# Altium project H2H Main Board v1.0.PrjPCB
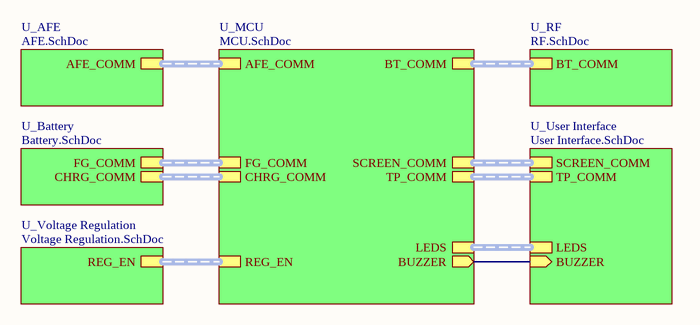
[diagram p0: Main Board.SchDoc]
7 sheets, 166 parts. Net scope: hierarchical (ports join the sheet entries above them; power ports are global).
Board file: Main Board.PcbDoc
Sheets:
  Main Board.SchDoc
    U_AFE = AFE.SchDoc
    U_Battery = Battery.SchDoc
    U_Voltage Regulation = Voltage Regulation.SchDoc
    U_RF = RF.SchDoc
    U_User Interface = User Interface.SchDoc
    U_MCU = MCU.SchDoc

## Sheet Main Board.SchDoc: Main Board
size A4; Date: 2016/01/06; Author: Samuel López; DocumentNumber: 1; SheetNumber: 1; SheetTotal: 7; Project: H2H Main Board

### Sub-sheets
U_AFE = AFE.SchDoc: AFE_COMM (harness AFE_COMM)
U_Battery = Battery.SchDoc: FG_COMM (harness FG_COMM), CHRG_COMM (harness CHRG_COMM)
U_MCU = MCU.SchDoc: SCREEN_COMM (harness SCREEN_COMM), AFE_COMM (harness AFE_COMM), FG_COMM (harness FG_COMM), CHRG_COMM (harness CHRG_COMM), REG_EN (harness REG_EN), BT_COMM (harness BT_COMM), TP_COMM (harness TP_COMM), LEDS (harness LEDS), BUZZER (out)
U_RF = RF.SchDoc: BT_COMM (harness BT_COMM)
U_User Interface = User Interface.SchDoc: SCREEN_COMM (harness SCREEN_COMM), TP_COMM (harness TP_COMM), LEDS (harness LEDS), BUZZER (in)
U_Voltage Regulation = Voltage Regulation.SchDoc: REG_EN (harness REG_EN)

### Nets
UI_BUZZER: sheet U_User Interface/BUZZER, sheet U_MCU/BUZZER

### Buses and harness runs
harness sheet U_AFE/AFE_COMM = sheet U_MCU/AFE_COMM
harness sheet U_Battery/CHRG_COMM = sheet U_MCU/CHRG_COMM
harness sheet U_Battery/FG_COMM = sheet U_MCU/FG_COMM
harness sheet U_MCU/BT_COMM = sheet U_RF/BT_COMM
harness sheet U_MCU/LEDS = sheet U_User Interface/LEDS
harness sheet U_MCU/REG_EN = sheet U_Voltage Regulation/REG_EN
harness sheet U_MCU/SCREEN_COMM = sheet U_User Interface/SCREEN_COMM
harness sheet U_MCU/TP_COMM = sheet U_User Interface/TP_COMM

### Notes on the sheet
- Project:
- Title:
- Sheet
- Author:
- of
- Date:

## Sheet AFE.SchDoc: Analog Front End
size A4; Date: 2016/01/04; Author: Samuel López; DocumentNumber: 2; SheetNumber: 2; SheetTotal: 7; Project: H2H Main Board
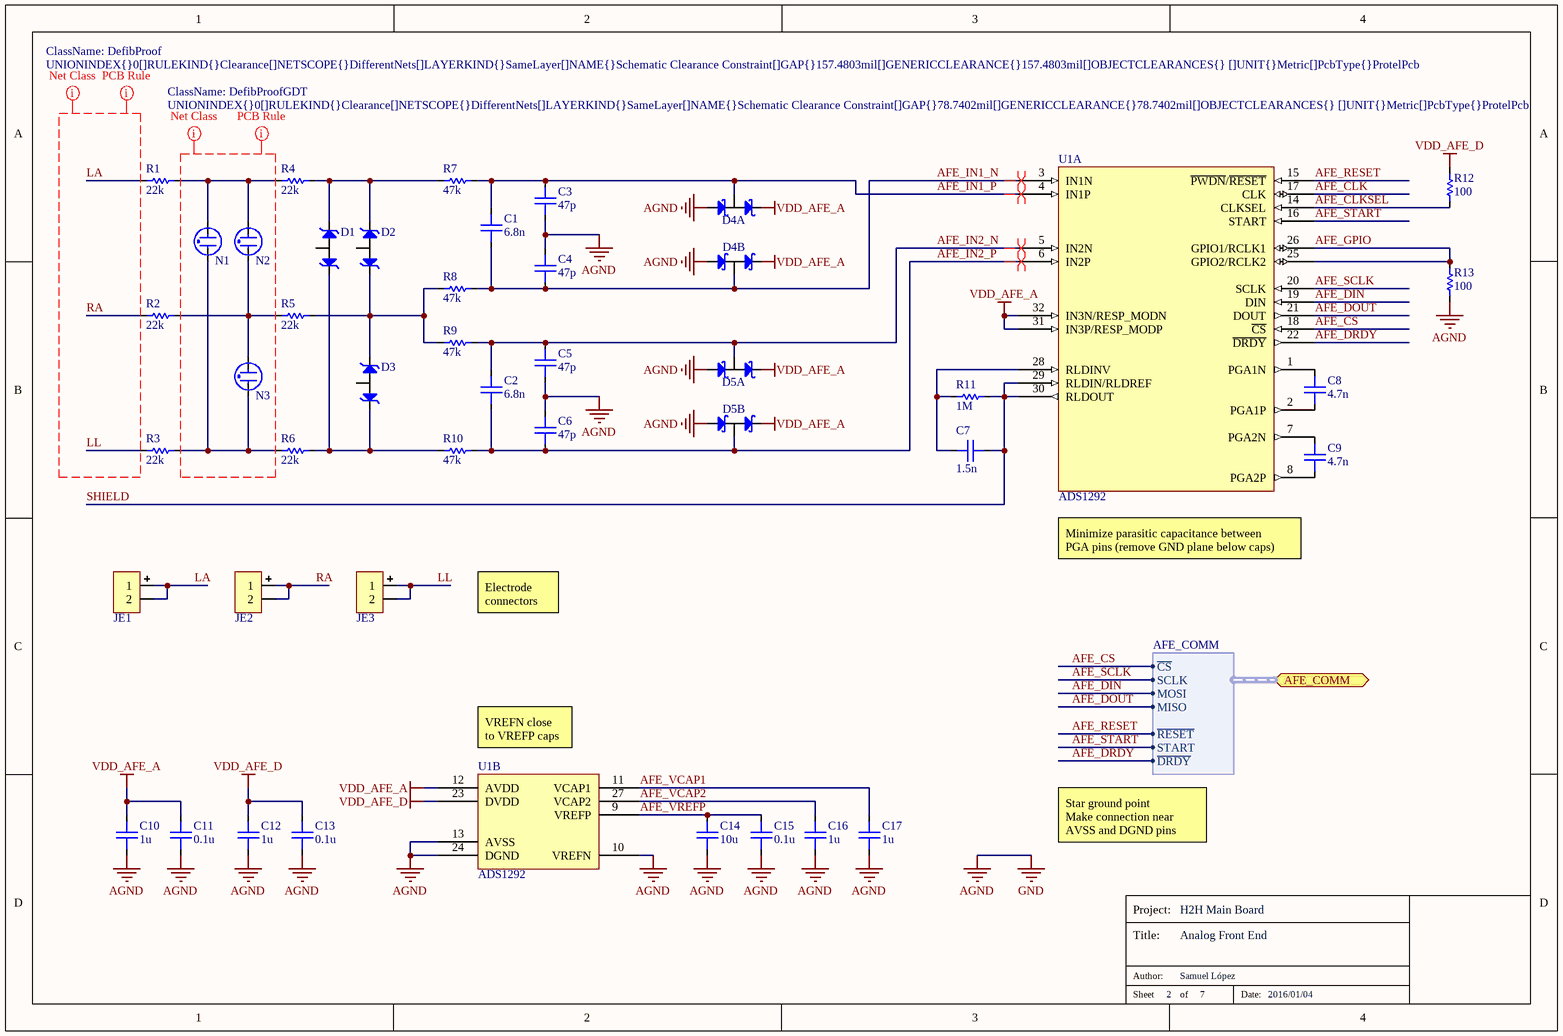
[diagram p1: AFE.SchDoc]

### Parts
C1  6.8n  [C0603]
C2  6.8n  [C0603]
C3  47p  [C0603]
C4  47p  [C0603]
C5  47p  [C0603]
C6  47p  [C0603]
C7  1.5n  [C0603]
C8  4.7n  [C0603]
C9  4.7n  [C0603]
C10  1u  [C0603]
C11  0.1u  [C0603]
C12  1u  [C0603]
C13  0.1u  [C0603]
C14  10u  [C0603]
C15  0.1u  [C0603]
C16  1u  [C0603]
C17  1u  [C0603]
D1  PESD5V0X1  [PESD5V0X1BT]  (value not drawn)
D2  PESD5V0X1  [PESD5V0X1BT]  (value not drawn)
D3  PESD5V0X1  [PESD5V0X1BT]  (value not drawn)
D4  BAS70DW-04  [BAS70DW-04]  (value not drawn)  (parts A,B of 2)
D5  BAS70DW-04  [BAS70DW-04]  (value not drawn)  (parts A,B of 2)
JE1  JST PH 2 Pin  [S2B-PH-K-S]  (value not drawn)
JE2  JST PH 2 Pin  [S2B-PH-K-S]  (value not drawn)
JE3  JST PH 2 Pin  [S2B-PH-K-S]  (value not drawn)
N1  GDT  [2051-09-SM]  (value not drawn)
N2  GDT  [2051-09-SM]  (value not drawn)
N3  GDT  [2051-09-SM]  (value not drawn)
R1  22k  [R2512]
R2  22k  [R2512]
R3  22k  [R2512]
R4  22k  [R2512]
R5  22k  [R2512]
R6  22k  [R2512]
R7  47k  [R0603]
R8  47k  [R0603]
R9  47k  [R0603]
R10  47k  [R0603]
R11  1M  [R0603]
R12  100  [R0603]
R13  100  [R0603]
U1  ADS1292  [ADS129x]  (parts A,B of 2)

### Ports
AFE_COMM (harness AFE_COMM)

### Harnesses
AFE_COMM: SCLK, MOSI, MISO, ~{CS}, ~{RESET}, START, ~{DRDY}

### Nets
AGND: C3.1 C4.2 C5.1 C6.2 C10.1 C11.1 C12.1 C13.1 C14.1 C15.1 C16.1 C17.1 D4.1(A1) D4.4(A2) D5.1(A1) D5.4(A2) R13.2 U1.10(VREFN) U1.13(AVSS) U1.24(DGND)  [also labelled GND]
VDD_AFE_A: C10.2 C11.2 D4.2(K1) D4.5(K2) D5.2(K1) D5.5(K2) U1.12(AVDD) U1.31(IN3P/RESP_MODP) U1.32(IN3N/RESP_MODN)
VDD_AFE_D: C12.2 C13.2 R12.1 U1.23(DVDD)
AFE_CLK: U1.17(CLK)
AFE_CLKSEL: R12.2 U1.14(CLKSEL)
AFE_CS: U1.18(~{CS}) ; port AFE_COMM.~{CS}
AFE_DIN: U1.19(DIN) ; port AFE_COMM.MOSI
AFE_DOUT: U1.21(DOUT) ; port AFE_COMM.MISO
AFE_DRDY: U1.22(~{DRDY}) ; port AFE_COMM.~{DRDY}
AFE_GPIO: R13.1 U1.25(GPIO2/RCLK2) U1.26(GPIO1/RCLK1)
AFE_IN1_N: C1.1 C4.1 D4.3(AK2) R8.2 U1.3(IN1N)
AFE_IN1_P: C1.2 C3.2 D4.6(AK1) R7.2 U1.4(IN1P)
AFE_IN2_N: C2.2 C5.2 D5.6(AK1) R9.2 U1.5(IN2N)
AFE_IN2_P: C2.1 C6.1 D5.3(AK2) R10.2 U1.6(IN2P)
AFE_RESET: U1.15(~{PWDN}/~{RESET}) ; port AFE_COMM.~{RESET}
AFE_SCLK: U1.20(SCLK) ; port AFE_COMM.SCLK
AFE_START: U1.16(START) ; port AFE_COMM.START
AFE_VCAP1: C17.2 U1.11(VCAP1)
AFE_VCAP2: C16.2 U1.27(VCAP2)
AFE_VREFP: C14.2 C15.2 U1.9(VREFP)
LA: JE1.1 JE1.2 R1.1
LL: JE3.1 JE3.2 R3.1
RA: JE2.1 JE2.2 R2.1
SHIELD: C7.1 R11.2 U1.29(RLDIN/RLDREF) U1.30(RLDOUT)
NetC7_2: C7.2 R11.1 U1.28(RLDINV)
NetC8_1: C8.1 U1.2(PGA1P)
NetC8_2: C8.2 U1.1(PGA1N)
NetC9_1: C9.1 U1.8(PGA2P)
NetC9_2: C9.2 U1.7(PGA2N)
NetD1_1: D1.1(K1) D3.1(K1) R6.2 R10.1
NetD1_2: D1.2(K2) D2.2(K2) R4.2 R7.1
NetD2_1: D2.1(K1) D3.2(K2) R5.2 R8.1 R9.1
NetN1_1: N1.1 N3.1 R3.2 R6.1
NetN1_2: N1.2 N2.2 R1.2 R4.1
NetN2_1: N2.1 N3.2 R2.2 R5.1

Not connected (* = marked no-connect by the designer): D1 3(A); D2 3(A); D3 3(A)

### Layout directives
differential pair: AFE_IN1_N, AFE_IN1_P, AFE_IN2_N, AFE_IN2_P
net class DefibProof: LA, LL, RA
rule Clearance Constraint [Clearance = 4mm]: LA, LL, RA
net class DefibProofGDT: (no net found under the mark)
rule Clearance Constraint [Clearance = 2mm]: (no net found under the mark)

### Notes on the sheet
- Minimize parasitic capacitance between
  PGA pins (remove GND plane below caps)
- Electrode
  connectors
- (near U1) VREFN close
  to VREFP caps
- Star ground point
  Make connection near AVSS and DGND pins
- Project:
- Title:
- Sheet
- Author:
- of
- Date:

### Library data of the parts
C1-C17 = Capacitor: Rated Voltage: *
  C1 C2: Value: 6.8n
  C3-C6: Value: 47p
  C7: Value: 1.5n
  C8 C9: Value: 4.7n
  C10 C12 C16 C17: Value: 1u
  C11 C13 C15: Value: 0.1u
  C14: Value: 10u
D1-D3 = PESD5V0X1: TVS - Bidirectional Zener Diode; Capacitance: 1 pF; Supplier 1: Digi-Key; Supplier Part Number 1: 568-4676-1-ND
D4 D5 = BAS70DW-04: TVS - Dual Schottky Rail-to-rail Protection; Supplier 1: Digi-Key; Supplier Part Number 1: BAS70DW-04FDICT-ND
JE1-JE3 = S2B-PH-K-S: Conn - Battery, Male, 2 Pin, PCB, Right Angle; Supplier 1: Digi-Key; Supplier Part Number 1: 455-1719-ND
N1-N3 = 2051-09-SM: TVS - Gas Discharge Tube; DC Sparkover: 90 V; Impulse Sparkover (1000V/us): <600 V; Glow Voltage: 70 V; Arc Voltage: 10 V; Glow-Arc Transition Current: <1 A; Impulse Sparkover (100V/us): <500 V; Supplier 1: Digi-Key; Supplier Part Number 1: 2051-09-SM-RPLFCT-ND
R1-R13 = Resistor: Power: *
  R1-R6: Value: 22k
  R7-R10: Value: 47k
  R11: Value: 1M
  R12 R13: Value: 100
U1 = ADS1292: IC - Analog Front End - Medical; Supplier 1: Digi-Key; Supplier Part Number 1: 296-30137-5-ND

## Sheet Battery.SchDoc: Battery
size A4; Date: 2016/01/04; Author: Samuel López; DocumentNumber: 3; SheetNumber: 3; SheetTotal: 7; Project: H2H Main Board
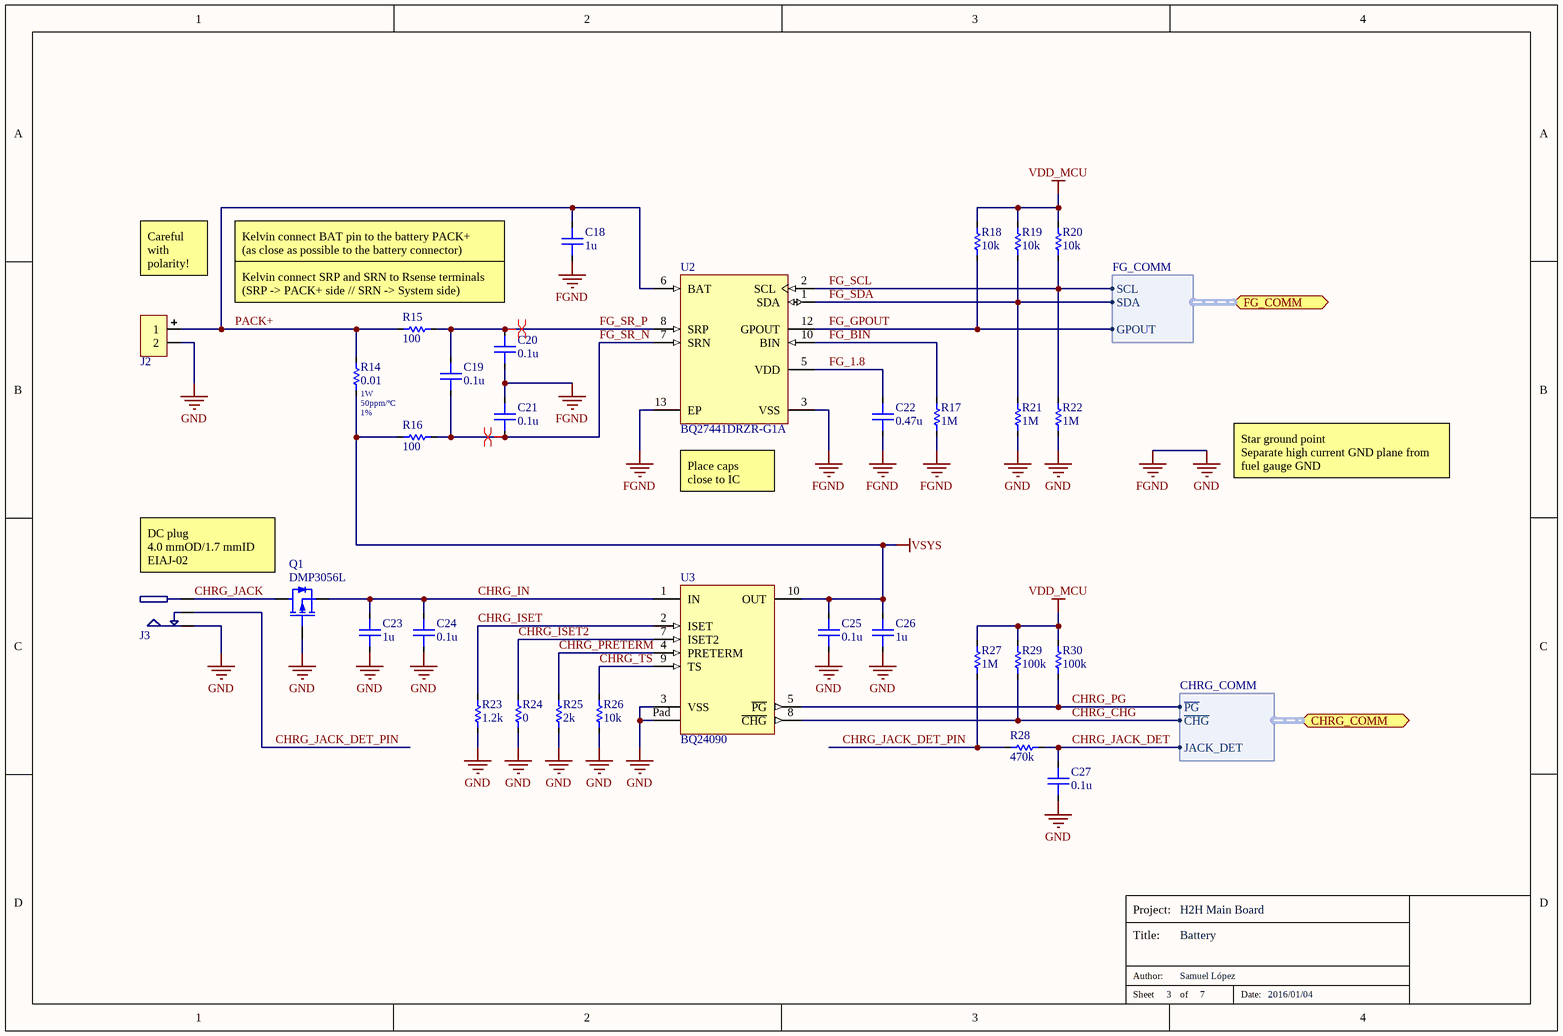
[diagram p2: Battery.SchDoc]

### Parts
C18  1u  [C0603]
C19  0.1u  [C0603]
C20  0.1u  [C0603]
C21  0.1u  [C0603]
C22  0.47u  [C0603]
C23  1u  [C0603]
C24  0.1u  [C0603]
C25  0.1u  [C0603]
C26  1u  [C0603]
C27  0.1u  [C0603]
J2  JST PH 2 Pin  [S2B-PH-K-S]  (value not drawn)
J3  PJ-018H-SMT  [PJ-018H-SMT]  (value not drawn)
Q1  DMP3056L  [DMP3056L]
R14  0.01  Power: 1W  Tolerance: 1%  Temp. coef.: 50ppm/ºC  [R1206]
R15  100  [R0603]
R16  100  [R0603]
R17  1M  [R0603]
R18  10k  [R0603]
R19  10k  [R0603]
R20  10k  [R0603]
R21  1M  [R0603]
R22  1M  [R0603]
R23  1.2k  [R0603]
R24  0  [R0603]
R25  2k  [R0603]
R26  10k  [R0603]
R27  1M  [R0603]
R28  470k  [R0603]
R29  100k  [R0603]
R30  100k  [R0603]
U2  BQ27441DRZR-G1A  [BQ27441DRZx-G1A]
U3  BQ24090  [BQ24090]

### Ports
CHRG_COMM (harness CHRG_COMM), FG_COMM (harness FG_COMM)

### Harnesses
FG_COMM: SCL, SDA, GPOUT
CHRG_COMM: ~{PG}, ~{CHG}, JACK_DET

### Nets
FGND: C18.1 C20.1 C21.2 C22.1 C23.1 C24.1 C25.1 C26.1 C27.1 J2.2 J3.2 Q1.1(G) R17.2 R21.2 R22.2 R23.2 R24.2 R25.2 R26.2 U2.3(VSS) U2.13(EP) U3.3(VSS) U3.Pad(Thermal)  [also labelled GND]  [project net AGND]
VDD_MCU: R18.1 R19.1 R20.1 R27.1 R29.1 R30.1
VSYS: C25.2 C26.2 R14.2 R16.1 U3.10(OUT)
CHRG_CHG: R29.2 U3.8(~{CHG}) ; port CHRG_COMM.~{CHG}
CHRG_IN: C23.2 C24.2 Q1.2(S) U3.1(IN)
CHRG_ISET: R23.1 U3.2(ISET)
CHRG_ISET2: R24.1 U3.7(ISET2)
CHRG_JACK: J3.1 Q1.3(D)
CHRG_JACK_DET: C27.2 R28.1 ; port CHRG_COMM.JACK_DET
CHRG_JACK_DET_PIN: J3.3 R27.2 R28.2
CHRG_PG: R30.2 U3.5(~{PG}) ; port CHRG_COMM.~{PG}
CHRG_PRETERM: R25.1 U3.4(PRETERM)
CHRG_TS: R26.1 U3.9(TS)
FG_1.8: C22.2 U2.5(VDD)
FG_BIN: R17.1 U2.10(BIN)
FG_GPOUT: R18.2 U2.12(GPOUT) ; port FG_COMM.GPOUT
FG_SCL: R20.2 R22.1 U2.2(SCL) ; port FG_COMM.SCL
FG_SDA: R19.2 R21.1 U2.1(SDA) ; port FG_COMM.SDA
FG_SR_N: C19.1 C21.1 R16.2 U2.7(SRN)
FG_SR_P: C19.2 C20.2 R15.2 U2.8(SRP)
PACK+: C18.2 J2.1 R14.1 R15.1 U2.6(BAT)

### Layout directives
differential pair: FG_SR_N, FG_SR_P

### Notes on the sheet
- Careful with
  polarity!
- Kelvin connect BAT pin to the battery PACK+
  (as close as possible to the battery connector)
- Kelvin connect SRP and SRN to Rsense terminals
  (SRP -> PACK+ side // SRN -> System side)
- (near U2) Place caps
  close to IC
- Star ground point
  Separate high current GND plane from
  fuel gauge GND
- DC plug
  4.0 mmOD/1.7 mmID
  EIAJ-02
- Project:
- Title:
- Sheet
- Author:
- of
- Date:

### Library data of the parts
C18-C27 = Capacitor: Rated Voltage: *
  C18 C23 C26: Value: 1u
  C19-C21 C24 C25 C27: Value: 0.1u
  C22: Value: 0.47u
J2 = S2B-PH-K-S: as JE1 on sheet AFE; Supplier 1: Digi-Key; Supplier Part Number 1: 455-1719-ND
J3 = PJ-018H-SMT: Conn - DC Power Plug - 4.0 mmOD / 1.7 mmID; Inner Diameter: 1.7 mm; Outer Diameter: 4.0 mm; DC Conn Standard: EIAJ-02; Supplier 1: Digi-Key; Supplier Part Number 1: CP-018HPJCT-ND
Q1 = DMP3056L: Transistor - MOSFET, P-Channel, 30V, 4.3A; RDSon @ VGS =-4.5V: 50 m; Supplier 1: Digi-Key; Supplier Part Number 1: DMP3056L-7DICT-ND
R14-R30 = Resistor
  R14: Value: 0.01; Supplier 1: Digi-Key; Supplier Part Number 1: MCS1632R010FERCT-ND
  R15 R16: Value: 100; Power: *
  R17 R21 R22 R27: Value: 1M; Power: *
  R18-R20 R26: Value: 10k; Power: *
  R23: Value: 1.2k; Power: *
  R24: Value: 0; Power: *
  R25: Value: 2k; Power: *
  R28: Value: 470k; Power: *
  R29 R30: Value: 100k; Power: *
U2 = BQ27441DRZR-G1A: IC - Fuel Gauge, System-Side Impedance Track; PartNumber: BQ27410DRZR-G1A; Manufacturer: Texas Instruments; Eco-Plan: Green (RoHS & no Sb/Br); Lead Acid: N; Li-Ion: Y; SubFamily: Battery Fuel Gauge; DatasheetVersion: SLUSAF4; PackageVersion: revB, Apr-2006; PackageReference: DRZ12-1950X2450TP; PackageDescription: 12-Pin Plastic Small Outline No-Lead, 4 x 2.5 x 1 mm Body, 0.4 mm Pitch, Exposed Pad, Pb-Free; Li-Polymer: Y; NiCd: N; NiMH: N; Over Voltage Protection: N; Mounting Technology: Surface Mount; ComponentLink1Description: Datasheet; ComponentLink1URL: http://www.ti.com/general/docs/lit/getliterature.tsp?genericPartNumber=BQ27410-G1&fileType=pdf; Supplier 1: Digi-Key; Supplier Part Number 1: 296-39941-1-ND
U3 = BQ24090: IC - Battery Charger, Single Cell Li-Ion/LiPo, 1A; Supplier 1: Digi-Key; Supplier Part Number 1: 296-38875-1-ND

## Sheet Voltage Regulation.SchDoc: Voltage Regulation
size A4; Date: 2016/01/05; Author: Samuel López; DocumentNumber: 4; SheetNumber: 4; SheetTotal: 7; Project: H2H Main Board
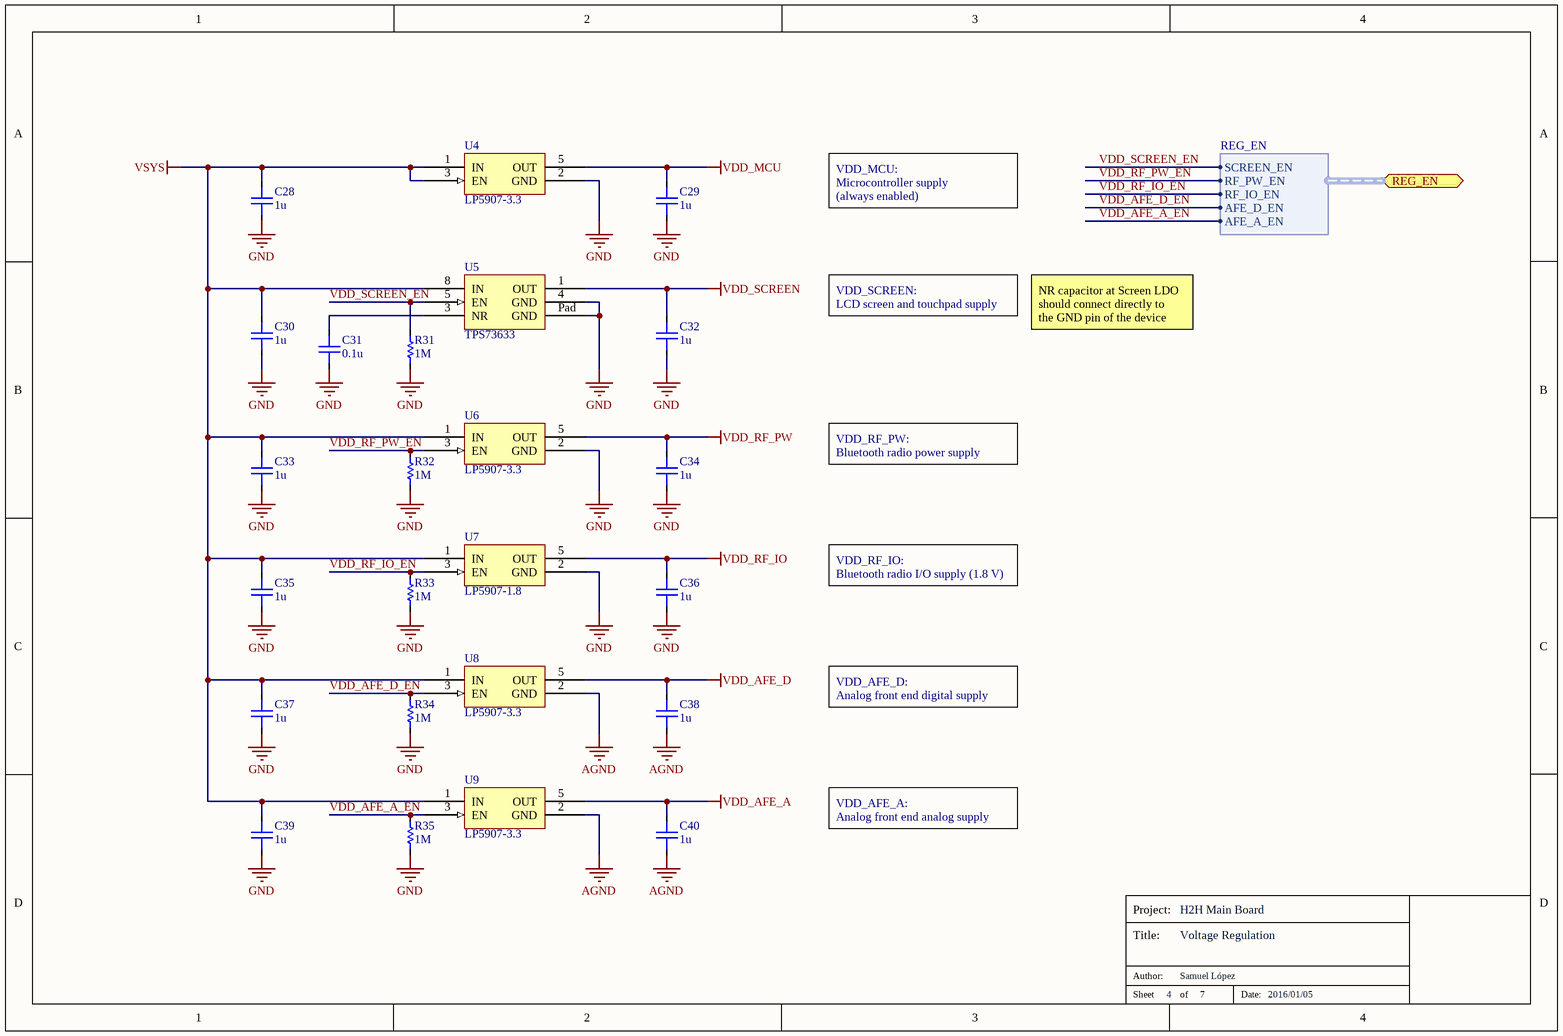
[diagram p3: Voltage Regulation.SchDoc]

### Parts
C28  1u  [C0603]
C29  1u  [C0603]
C30  1u  [C0603]
C31  0.1u  [C0603]
C32  1u  [C0603]
C33  1u  [C0603]
C34  1u  [C0603]
C35  1u  [C0603]
C36  1u  [C0603]
C37  1u  [C0603]
C38  1u  [C0603]
C39  1u  [C0603]
C40  1u  [C0603]
R31  1M  [R0603]
R32  1M  [R0603]
R33  1M  [R0603]
R34  1M  [R0603]
R35  1M  [R0603]
U4  LP5907-3.3  [LP5907]
U5  TPS73633  [TPS73633]
U6  LP5907-3.3  [LP5907]
U7  LP5907-1.8  [LP5907]
U8  LP5907-3.3  [LP5907]
U9  LP5907-3.3  [LP5907]

### Ports
REG_EN (harness REG_EN)

### Harnesses
REG_EN: SCREEN_EN, RF_PW_EN, RF_IO_EN, AFE_D_EN, AFE_A_EN

### Nets
AGND: C28.1 C29.1 C30.1 C31.1 C32.1 C33.1 C34.1 C35.1 C36.1 C37.1 C38.1 C39.1 C40.1 R31.2 R32.2 R33.2 R34.2 R35.2 U4.2(GND) U5.4(GND) U5.Pad(GND) U6.2(GND) U7.2(GND) U8.2(GND) U9.2(GND)  [also labelled GND]
VDD_AFE_A: C40.2 U9.5(OUT)
VDD_AFE_D: C38.2 U8.5(OUT)
VDD_MCU: C29.2 U4.5(OUT)
VDD_RF_IO: C36.2 U7.5(OUT)
VDD_RF_PW: C34.2 U6.5(OUT)
VDD_SCREEN: C32.2 U5.1(OUT)
VSYS: C28.2 C30.2 C33.2 C35.2 C37.2 C39.2 U4.1(IN) U4.3(EN) U5.8(IN) U6.1(IN) U7.1(IN) U8.1(IN) U9.1(IN)
VDD_AFE_A_EN: R35.1 U9.3(EN) ; port REG_EN.AFE_A_EN
VDD_AFE_D_EN: R34.1 U8.3(EN) ; port REG_EN.AFE_D_EN
VDD_RF_IO_EN: R33.1 U7.3(EN) ; port REG_EN.RF_IO_EN
VDD_RF_PW_EN: R32.1 U6.3(EN) ; port REG_EN.RF_PW_EN
VDD_SCREEN_EN: R31.1 U5.5(EN) ; port REG_EN.SCREEN_EN
NetC31_2: C31.2 U5.3(NR)

### Notes on the sheet
- VDD_MCU:
  Microcontroller supply
  (always enabled)
- VDD_SCREEN:
  LCD screen and touchpad supply
- NR capacitor at Screen LDO
  should connect directly to
  the GND pin of the device
- VDD_RF_PW:
  Bluetooth radio power supply
- VDD_RF_IO:
  Bluetooth radio I/O supply (1.8 V)
- VDD_AFE_D:
  Analog front end digital supply
- VDD_AFE_A:
  Analog front end analog supply
- Project:
- Title:
- Sheet
- Author:
- of
- Date:

### Library data of the parts
C28-C40 = Capacitor: Rated Voltage: *
  C28-C30 C32-C40: Value: 1u
  C31: Value: 0.1u
R31-R35 = Resistor: Value: 1M; Power: *
U4 U6 U8 U9 = LP5907-3.3: Voltage Regulator - Linear; Supplier 1: Digi-Key; Supplier Part Number 1: 296-38557-1-ND
U5 = TPS73633: Voltage Regulator - Linear; Supplier 1: Digi-Key; Supplier Part Number 1: 296-17884-1-ND
U7 = LP5907-1.8: Voltage Regulator - Linear; Supplier 1: Digi-Key; Supplier Part Number 1: 296-41463-1-ND

## Sheet RF.SchDoc: RF
size A4; Date: 2016/01/05; Author: Samuel López; DocumentNumber: 5; SheetNumber: 5; SheetTotal: 7; Project: H2H Main Board
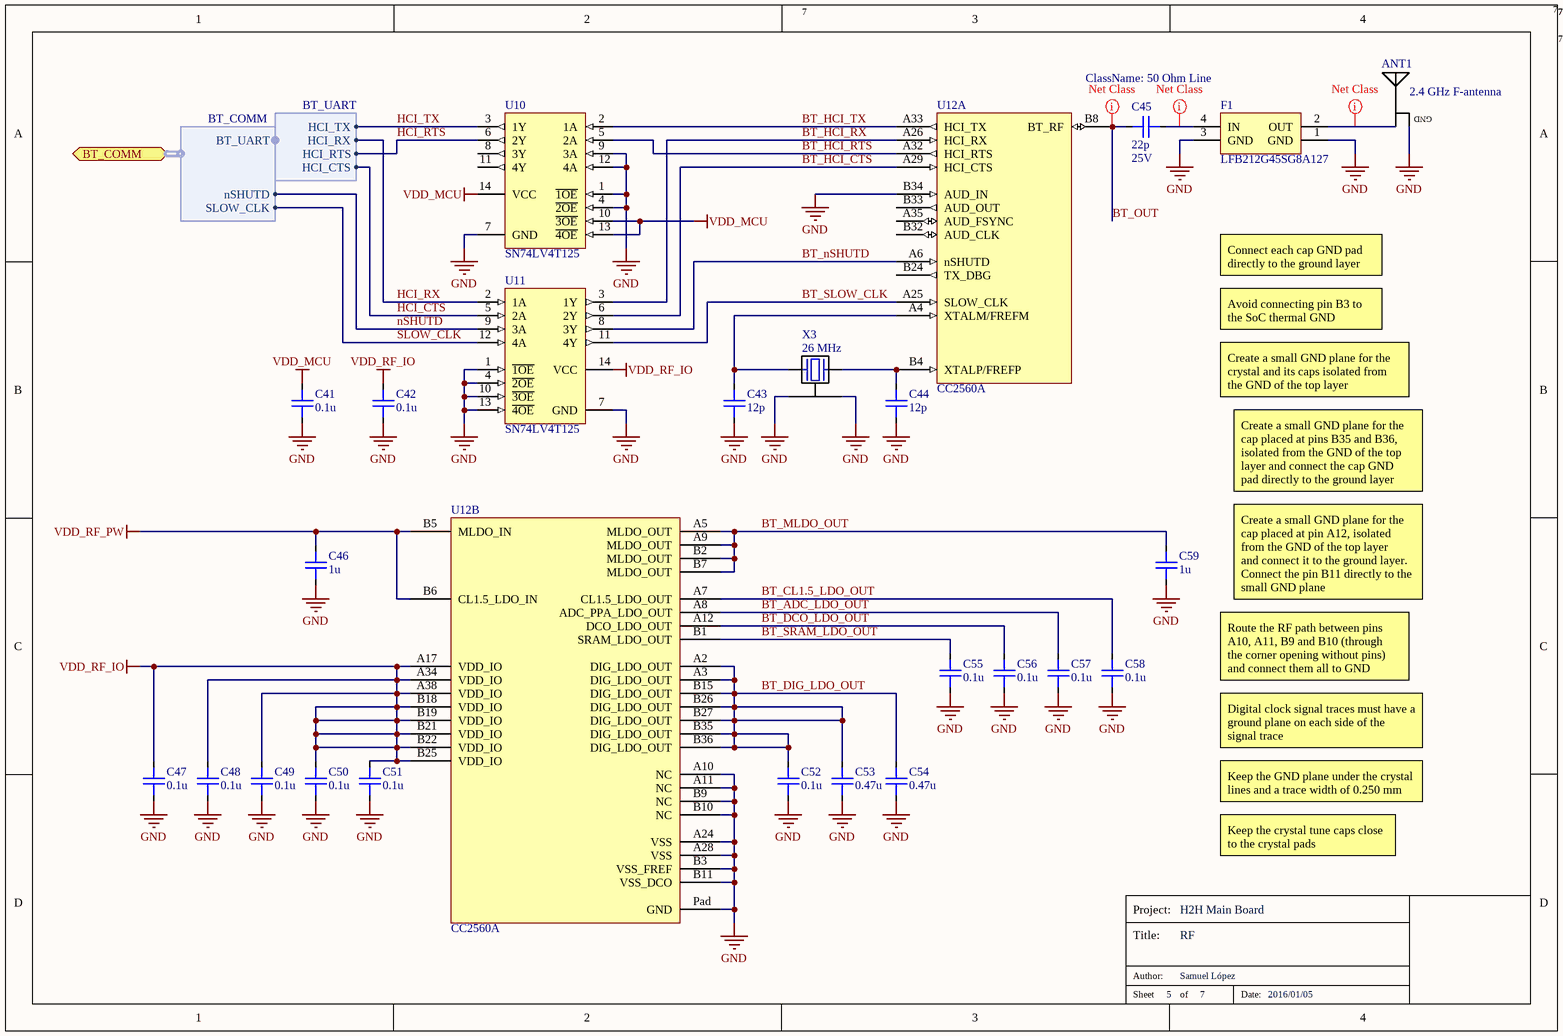
[diagram p4: RF.SchDoc]

### Parts
ANT1  2.4 GHz F-antenna  [Antenna Inverted F 2.4 GHz]  (net tie, no BOM)
C41  0.1u  [C0603]
C42  0.1u  [C0603]
C43  12p  [C0402]
C44  12p  [C0402]
C45  22p  Rated Voltage: 25V  [C0402]
C46  1u  [C0402]
C47  0.1u  [C0402]
C48  0.1u  [C0402]
C49  0.1u  [C0402]
C50  0.1u  [C0402]
C51  0.1u  [C0402]
C52  0.1u  [C0402]
C53  0.47u  [C0402]
C54  0.47u  [C0402]
C55  0.1u  [C0402]
C56  0.1u  [C0402]
C57  0.1u  [C0402]
C58  0.1u  [C0402]
C59  1u  [C0402]
F1  LFB212G45SG8A127  [LFB212G45SG8A127]
U10  SN74LV4T125  [SN74LV4T125]
U11  SN74LV4T125  [SN74LV4T125]
U12  CC2560A  [CC256x]  (parts A,B of 2)
X3  Frequency: 26 MHz  [NX2016SA]  (hidden comment: NX2016SA)

### Ports
BT_COMM (harness BT_COMM)

### Harnesses
BT_COMM: BT_UART, nSHUTD, SLOW_CLK
BT_UART: HCI_TX, HCI_RX, HCI_RTS, HCI_CTS

### Nets
GND: ANT1.2(GND) C41.1 C42.1 C43.1 C44.1 C46.1 C47.1 C48.1 C49.1 C50.1 C51.1 C52.1 C53.1 C54.1 C55.1 C56.1 C57.1 C58.1 C59.1 F1.1(GND) F1.3(GND) U10.1(~{1OE}) U10.4(~{2OE}) U10.7(GND) U10.9(3A) U10.12(4A) U11.1(~{1OE}) U11.4(~{2OE}) U11.7(GND) U11.10(~{3OE}) U11.13(~{4OE}) U12.A10(NC) U12.A11(NC) U12.A24(VSS) U12.A28(VSS) U12.B3(VSS_FREF) U12.B9(NC) U12.B10(NC) U12.B11(VSS_DCO) U12.B34(AUD_IN) U12.Pad(GND) X3.2 X3.4  [project net AGND]
VDD_MCU: C41.2 U10.10(~{3OE}) U10.13(~{4OE}) U10.14(VCC)
VDD_RF_IO: C42.2 C47.2 C48.2 C49.2 C50.2 C51.2 U11.14(VCC) U12.A17(VDD_IO) U12.A34(VDD_IO) U12.A38(VDD_IO) U12.B18(VDD_IO) U12.B19(VDD_IO) U12.B21(VDD_IO) U12.B22(VDD_IO) U12.B25(VDD_IO)
VDD_RF_PW: C46.2 U12.B5(MLDO_IN) U12.B6(CL1.5_LDO_IN)
BT_ADC_LDO_OUT: C57.2 U12.A8(ADC_PPA_LDO_OUT)
BT_CL1.5_LDO_OUT: C58.2 U12.A7(CL1.5_LDO_OUT)
BT_DCO_LDO_OUT: C56.2 U12.A12(DCO_LDO_OUT)
BT_DIG_LDO_OUT: C52.2 C53.2 C54.2 U12.A2(DIG_LDO_OUT) U12.A3(DIG_LDO_OUT) U12.B15(DIG_LDO_OUT) U12.B26(DIG_LDO_OUT) U12.B27(DIG_LDO_OUT) U12.B35(DIG_LDO_OUT) U12.B36(DIG_LDO_OUT)
BT_HCI_CTS: U11.6(2Y) U12.A29(HCI_CTS)
BT_HCI_RTS: U10.5(2A) U12.A32(HCI_RTS)
BT_HCI_RX: U11.3(1Y) U12.A26(HCI_RX)
BT_HCI_TX: U10.2(1A) U12.A33(HCI_TX)
BT_MLDO_OUT: C59.2 U12.A5(MLDO_OUT) U12.A9(MLDO_OUT) U12.B2(MLDO_OUT) U12.B7(MLDO_OUT)
BT_nSHUTD: U11.8(3Y) U12.A6(nSHUTD)
BT_OUT: C45.1 U12.B8(BT_RF)
BT_SLOW_CLK: U11.11(4Y) U12.A25(SLOW_CLK)
BT_SRAM_LDO_OUT: C55.2 U12.B1(SRAM_LDO_OUT)
HCI_CTS: U11.5(2A) ; harness BT_UART.HCI_CTS
HCI_RTS: U10.6(2Y) ; harness BT_UART.HCI_RTS
HCI_RX: U11.2(1A) ; harness BT_UART.HCI_RX
HCI_TX: U10.3(1Y) ; harness BT_UART.HCI_TX
nSHUTD: U11.9(3A) ; port BT_COMM.nSHUTD
SLOW_CLK: U11.12(4A) ; port BT_COMM.SLOW_CLK
NetANT1_1: ANT1.1(IN) F1.2(OUT)
NetC43_2: C43.2 U12.A4(XTALM/FREFM) X3.1
NetC44_2: C44.2 U12.B4(XTALP/FREFP) X3.3
NetC45_2: C45.2 F1.4(IN)

Not connected (* = marked no-connect by the designer): U10 8(3Y) 11(4Y); U12 A35(AUD_FSYNC) B24(TX_DBG) B32(AUD_CLK) B33(AUD_OUT)

### Layout directives
net class 50 Ohm Line: BT_OUT, NetANT1_1, NetC45_2

### Notes on the sheet
- Connect each cap GND pad
  directly to the ground layer
- Avoid connecting pin B3 to
  the SoC thermal GND
- Create a small GND plane for the
  crystal and its caps isolated from
  the GND of the top layer
- Create a small GND plane for the
  cap placed at pins B35 and B36,
  isolated from the GND of the top
  layer and connect the cap GND
  pad directly to the ground layer
- Create a small GND plane for the
  cap placed at pin A12, isolated
  from the GND of the top layer
  and connect it to the ground layer.
  Connect the pin B11 directly to the
  small GND plane
- Route the RF path between pins
  A10, A11, B9 and B10 (through
  the corner opening without pins)
  and connect them all to GND
- Digital clock signal traces must have a
  ground plane on each side of the
  signal trace
- Keep the GND plane under the crystal
  lines and a trace width of 0.250 mm
- Keep the crystal tune caps close
  to the crystal pads
- Project:
- Title:
- Sheet
- Author:
- of
- Date:

### Library data of the parts
ANT1 = ANT 2.4 GHz: Antenna - Inverted F 2.4 GHz
C41-C59 = Capacitor
  C41 C42 C47-C52 C55-C58: Value: 0.1u; Rated Voltage: *
  C43 C44: Value: 12p; Rated Voltage: *
  C45: Value: 22p
  C46 C59: Value: 1u; Rated Voltage: *
  C53 C54: Value: 0.47u; Rated Voltage: *
F1 = LFB212G45SG8A127: Filter - RF 2.4 GHz; Supplier 1: Digi-Key; Supplier Part Number 1: 490-5021-1-ND
U10 U11 = SN74LV4T125: IC - Voltage Level Translator; Supplier 1: Digi-Key; Supplier Part Number 1: 296-40546-1-ND
U12 = CC2560A: IC - Bluetooth 4.0 controller (BR/EDR); Supplier 1: Farnell; Supplier Part Number 1: 2334559
X3 = NX2016SA: Crystal - 26 MHz; Supplier 1: Digi-Key; Supplier Part Number 1: 644-1220-1-ND

## Sheet User Interface.SchDoc: User Interface
size A4; Date: 2016/01/05; Author: Samuel López; DocumentNumber: 6; SheetNumber: 6; SheetTotal: 7; Project: H2H Main Board
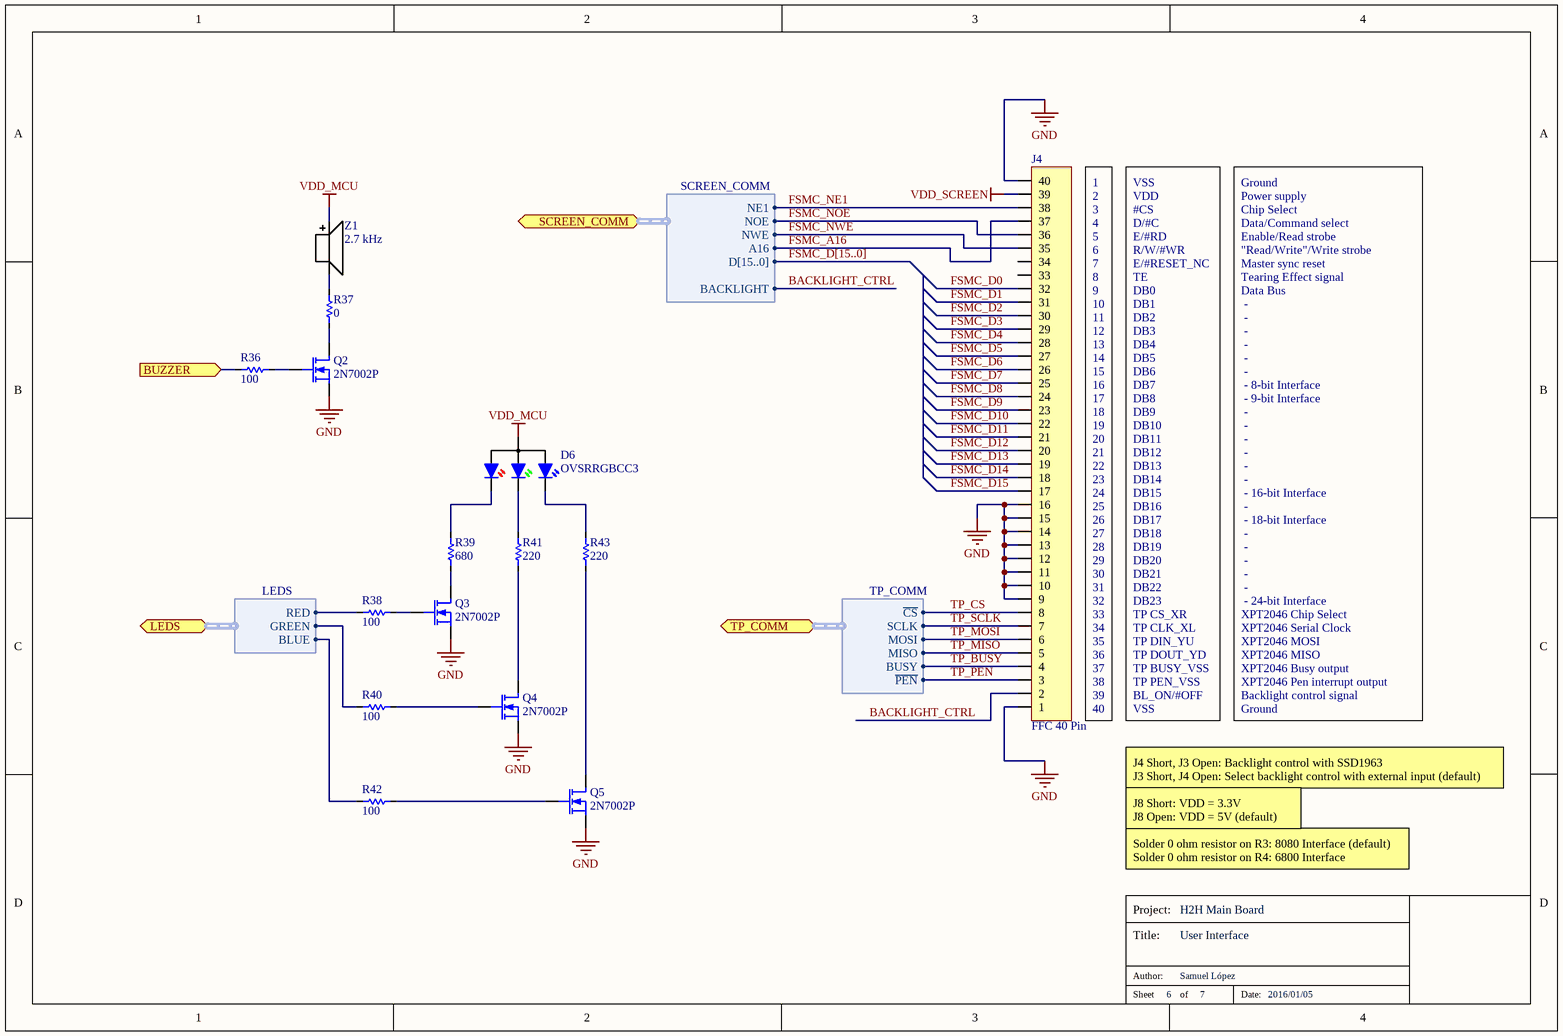
[diagram p5: User Interface.SchDoc]

### Parts
D6  OVSRRGBCC3  [OVSRRGBCC3/SIDE]
J4  FFC 40 Pin  [ER-CON40HB-2]
Q2  2N7002P  [2N7002P]
Q3  2N7002P  [2N7002P]
Q4  2N7002P  [2N7002P]
Q5  2N7002P  [2N7002P]
R36  100  [R0603]
R37  0  [R0603]
R38  100  [R0603]
R39  680  [R0603]
R40  100  [R0603]
R41  220  [R0603]
R42  100  [R0603]
R43  220  [R0603]
Z1  2.7 kHz  [KSSG74B16]

### Ports
BUZZER (in), LEDS (harness LEDS), SCREEN_COMM (harness SCREEN_COMM), TP_COMM (harness TP_COMM)

### Harnesses
SCREEN_COMM: NE1, NOE, NWE, A16, D[15..0], BACKLIGHT
TP_COMM: ~{CS}, SCLK, MOSI, MISO, BUSY, ~{PEN}
LEDS: RED, GREEN, BLUE

### Nets
GND: J4.1 J4.9 J4.10 J4.11 J4.12 J4.13 J4.14 J4.15 J4.16 J4.40 Q2.2(S) Q3.2(S) Q4.2(S) Q5.2(S)  [project net AGND]
VDD_MCU: D6.4(A) Z1.1(+)
VDD_SCREEN: J4.39
BACKLIGHT_CTRL: J4.2 ; port SCREEN_COMM.BACKLIGHT
FSMC_A16: J4.37 ; port SCREEN_COMM.A16
FSMC_D0: J4.32
FSMC_D1: J4.31
FSMC_D2: J4.30
FSMC_D3: J4.29
FSMC_D4: J4.28
FSMC_D5: J4.27
FSMC_D6: J4.26
FSMC_D7: J4.25
FSMC_D8: J4.24
FSMC_D9: J4.23
FSMC_D10: J4.22
FSMC_D11: J4.21
FSMC_D12: J4.20
FSMC_D13: J4.19
FSMC_D14: J4.18
FSMC_D15: J4.17
FSMC_NE1: J4.38 ; port SCREEN_COMM.NE1
FSMC_NOE: J4.36 ; port SCREEN_COMM.NOE
FSMC_NWE: J4.35 ; port SCREEN_COMM.NWE
TP_BUSY: J4.4 ; port TP_COMM.BUSY
TP_CS: J4.8 ; port TP_COMM.~{CS}
TP_MISO: J4.5 ; port TP_COMM.MISO
TP_MOSI: J4.6 ; port TP_COMM.MOSI
TP_PEN: J4.3 ; port TP_COMM.~{PEN}
TP_SCLK: J4.7 ; port TP_COMM.SCLK
UI_BUZZER: R36.1 ; port BUZZER
UI_LED_B: R42.2 ; port LEDS.BLUE
UI_LED_G: R40.1 ; port LEDS.GREEN
UI_LED_R: R38.1 ; port LEDS.RED
NetD6_1: D6.1(K_R) R39.2
NetD6_2: D6.2(K_G) R41.1
NetD6_3: D6.3(K_B) R43.2
NetQ2_1: Q2.1(G) R36.2
NetQ2_3: Q2.3(D) R37.2
NetQ3_1: Q3.1(G) R38.2
NetQ3_3: Q3.3(D) R39.1
NetQ4_1: Q4.1(G) R40.2
NetQ4_3: Q4.3(D) R41.2
NetQ5_1: Q5.1(G) R42.1
NetQ5_3: Q5.3(D) R43.1
NetR37_1: R37.1 Z1.2(-)

Not connected (* = marked no-connect by the designer): J4 33 34

### Buses and harness runs
bus FSMC_D[15..0]

### Notes on the sheet
- 1
  2
  3
  4
  5
  6
  7
  8
  9
  10
  11
  12
  13
  14
  15
  16
  17
  18
  19
  20
  21
  22
  23
  24
  25
  26
  27
  28
  29
  30
  31
  32
  33
  34
  35
  36
  37
  38
  39
  40
- VSS
  VDD
  #CS
  D/#C
  E/#RD
  R/W/#WR
  E/#RESET_NC
  TE
  DB0
  DB1
  DB2
  DB3
  DB4
  DB5
  DB6
  DB7
  DB8
  DB9
  DB10
  DB11
  DB12
  DB13
  DB14
  DB15
  DB16
  DB17
  DB18
  DB19
  DB20
  DB21
  DB22
  DB23
  TP CS_XR
  TP CLK_XL
  TP DIN_YU
  TP DOUT_YD
  TP BUSY_VSS
  TP PEN_VSS
  BL_ON/#OFF
  VSS
- Ground
  Power supply
  Chip Select
  Data/Command select
  Enable/Read strobe
  "Read/Write"/Write strobe
  Master sync reset
  Tearing Effect signal
  Data Bus
  -
  -
  -
  -
  -
  -
  - 8-bit Interface
  - 9-bit Interface
  -
  -
  -
  -
  -
  -
  - 16-bit Interface
  -
  - 18-bit Interface
  -
  -
  -
  -
  -
  - 24-bit Interface
  XPT2046 Chip Select
  XPT2046 Serial Clock
  XPT2046 MOSI
  XPT2046 MISO
  XPT2046 Busy output
  XPT2046 Pen interrupt output
  Backlight control signal
  Ground
- J4 Short, J3 Open: Backlight control with SSD1963
  J3 Short, J4 Open: Select backlight control with external input (default)
- J8 Short: VDD = 3.3V
  J8 Open: VDD = 5V (default)
- Solder 0 ohm resistor on R3: 8080 Interface (default)
  Solder 0 ohm resistor on R4: 6800 Interface
- Project:
- Title:
- Sheet
- Author:
- of
- Date:

### Library data of the parts
D6 = OVSRRGBCC3: LED - RGB, Top/Side-emmiting; Supplier 1: Digi-Key; Supplier Part Number 1: 365-1981-1-ND
J4 = ER-CON40HB-2: Conn - FFC/FPC, 40 Pin, 1.0mm Pitch, ZIF
Q2-Q5 = 2N7002P: Transistor - MOSFET, N-Channel, 60V, 300mA; Supplier 1: Digi-Key; Supplier Part Number 1: 568-5818-1-ND
R36-R43 = Resistor: Power: *
  R36 R38 R40 R42: Value: 100
  R37: Value: 0
  R39: Value: 680
  R41 R43: Value: 220
Z1 = KSSG74B16: Transductor - Buzzer 2.7 kHz; Supplier 1: Farnell; Supplier Part Number 1: 2215090; Resonant frequency: 2.7 kHz

## Sheet MCU.SchDoc: MCU
size A4; Date: 2016/01/06; Author: Samuel López; DocumentNumber: 7; SheetNumber: 7; SheetTotal: 7; Project: H2H Main Board
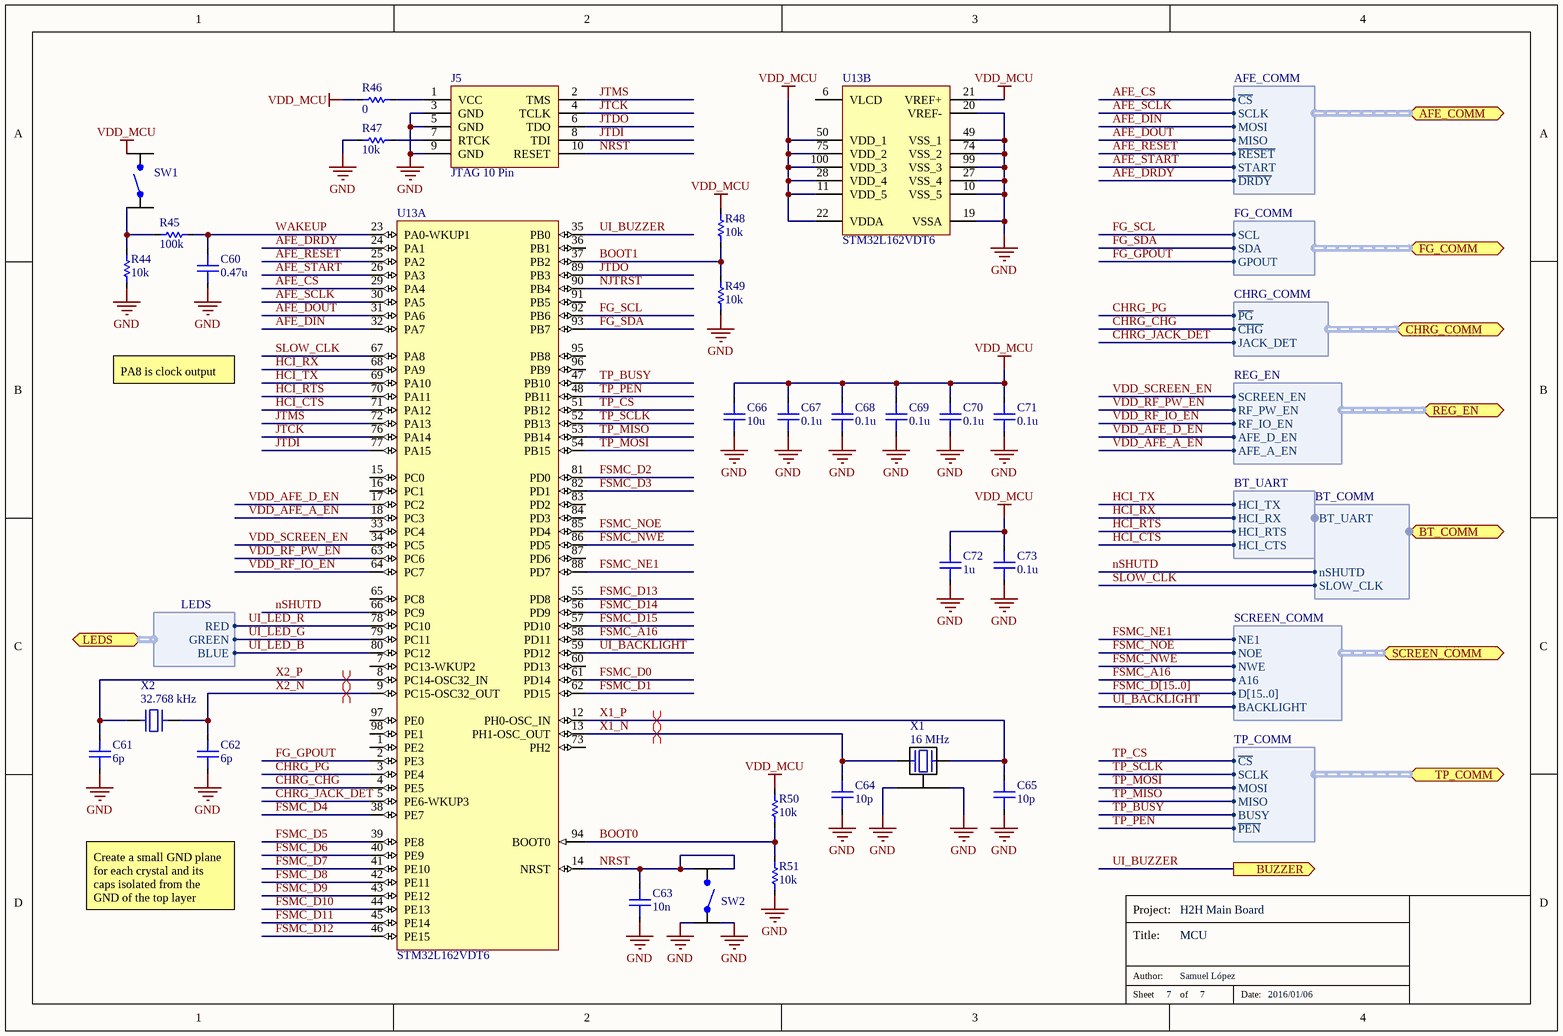
[diagram p6: MCU.SchDoc]

### Parts
C60  0.47u  [C0603]
C61  6p  [C0603]
C62  6p  [C0603]
C63  10n  [C0603]
C64  10p  [C0603]
C65  10p  [C0603]
C66  10u  [C0603]
C67  0.1u  [C0603]
C68  0.1u  [C0603]
C69  0.1u  [C0603]
C70  0.1u  [C0603]
C71  0.1u  [C0603]
C72  1u  [C0603]
C73  0.1u  [C0603]
J5  JTAG 10 Pin  [3220-10-0200-00]
R44  10k  [R0603]
R45  100k  [R0603]
R46  0  [R0603]
R47  10k  [R0603]
R48  10k  [R0603]
R49  10k  [R0603]
R50  10k  [R0603]
R51  10k  [R0603]
SW1  WS-TASU 436331045822  [WS-TASU 436331045822]  (value not drawn)
SW2  EVQ-Q2K01W  [EVQ-Q2K01W]  (value not drawn)
U13  STM32L162VDT6  [STM-LQFP100_N]  (parts A,B of 2)
X1  Frequency: 16 MHz  [ABM3B-16.000MHZ-10-1-U]  (hidden comment: ABM3B-16.000MHZ-10-1-U)
X2  Frequency: 32.768 kHz  [ABS07-120-32.768KHZ-T]  (hidden comment: ABS07-120-32.768KHZ-T)

### Ports
AFE_COMM (harness AFE_COMM), BT_COMM (harness BT_COMM), BUZZER (out), CHRG_COMM (harness CHRG_COMM), FG_COMM (harness FG_COMM), LEDS (harness LEDS), REG_EN (harness REG_EN), SCREEN_COMM (harness SCREEN_COMM), TP_COMM (harness TP_COMM)

### Harnesses
SCREEN_COMM: NE1, NOE, NWE, A16, D[15..0], BACKLIGHT
AFE_COMM: SCLK, MOSI, MISO, ~{CS}, ~{RESET}, START, ~{DRDY}
FG_COMM: SCL, SDA, GPOUT
CHRG_COMM: ~{PG}, ~{CHG}, JACK_DET
REG_EN: SCREEN_EN, RF_PW_EN, RF_IO_EN, AFE_D_EN, AFE_A_EN
BT_COMM: BT_UART, nSHUTD, SLOW_CLK
BT_UART: HCI_TX, HCI_RX, HCI_RTS, HCI_CTS
TP_COMM: ~{CS}, SCLK, MOSI, MISO, BUSY, ~{PEN}
LEDS: RED, GREEN, BLUE

### Nets
GND: C60.1 C61.1 C62.1 C63.1 C64.1 C65.1 C66.1 C67.1 C68.1 C69.1 C70.1 C71.1 C72.1 C73.1 J5.3(GND) J5.5(GND) J5.9(GND) R44.1 R47.1 R49.1 R51.1 SW2.1(A1) SW2.2(A2) U13.10(VSS_5) U13.19(VSSA) U13.20(VREF-) U13.27(VSS_4) U13.49(VSS_1) U13.74(VSS_2) U13.99(VSS_3) X1.2 X1.4  [project net AGND]
VDD_MCU: C66.2 C67.2 C68.2 C69.2 C70.2 C71.2 C72.2 C73.2 R46.1 R48.2 R50.2 SW1.2 U13.11(VDD_5) U13.21(VREF+) U13.22(VDDA) U13.28(VDD_4) U13.50(VDD_1) U13.75(VDD_2) U13.100(VDD_3)
AFE_CS: U13.29(PA4) ; port AFE_COMM.~{CS}
AFE_DIN: U13.32(PA7) ; port AFE_COMM.MOSI
AFE_DOUT: U13.31(PA6) ; port AFE_COMM.MISO
AFE_DRDY: U13.24(PA1) ; port AFE_COMM.~{DRDY}
AFE_RESET: U13.25(PA2) ; port AFE_COMM.~{RESET}
AFE_SCLK: U13.30(PA5) ; port AFE_COMM.SCLK
AFE_START: U13.26(PA3) ; port AFE_COMM.START
BOOT0: R50.1 R51.2 U13.94(BOOT0)
BOOT1: R48.1 R49.2 U13.37(PB2)
CHRG_CHG: U13.4(PE5) ; port CHRG_COMM.~{CHG}
CHRG_JACK_DET: U13.5(PE6-WKUP3) ; port CHRG_COMM.JACK_DET
CHRG_PG: U13.3(PE4) ; port CHRG_COMM.~{PG}
FG_GPOUT: U13.2(PE3) ; port FG_COMM.GPOUT
FG_SCL: U13.92(PB6) ; port FG_COMM.SCL
FG_SDA: U13.93(PB7) ; port FG_COMM.SDA
FSMC_A16: U13.58(PD11) ; port SCREEN_COMM.A16
FSMC_D0: U13.61(PD14)
FSMC_D1: U13.62(PD15)
FSMC_D2: U13.81(PD0)
FSMC_D3: U13.82(PD1)
FSMC_D4: U13.38(PE7)
FSMC_D5: U13.39(PE8)
FSMC_D6: U13.40(PE9)
FSMC_D7: U13.41(PE10)
FSMC_D8: U13.42(PE11)
FSMC_D9: U13.43(PE12)
FSMC_D10: U13.44(PE13)
FSMC_D11: U13.45(PE14)
FSMC_D12: U13.46(PE15)
FSMC_D13: U13.55(PD8)
FSMC_D14: U13.56(PD9)
FSMC_D15: U13.57(PD10)
FSMC_NE1: U13.88(PD7) ; port SCREEN_COMM.NE1
FSMC_NOE: U13.85(PD4) ; port SCREEN_COMM.NOE
FSMC_NWE: U13.86(PD5) ; port SCREEN_COMM.NWE
HCI_CTS: U13.71(PA12) ; harness BT_UART.HCI_CTS
HCI_RTS: U13.70(PA11) ; harness BT_UART.HCI_RTS
HCI_RX: U13.68(PA9) ; harness BT_UART.HCI_RX
HCI_TX: U13.69(PA10) ; harness BT_UART.HCI_TX
JTCK: J5.4(TCLK) U13.76(PA14)
JTDI: J5.8(TDI) U13.77(PA15)
JTDO: J5.6(TDO) U13.89(PB3)
JTMS: J5.2(TMS) U13.72(PA13)
NJTRST: U13.90(PB4)
NRST: C63.2 J5.10(RESET) SW2.3(B2) SW2.4(B1) U13.14(NRST)
nSHUTD: U13.66(PC9) ; port BT_COMM.nSHUTD
SLOW_CLK: U13.67(PA8) ; port BT_COMM.SLOW_CLK
TP_BUSY: U13.47(PB10) ; port TP_COMM.BUSY
TP_CS: U13.51(PB12) ; port TP_COMM.~{CS}
TP_MISO: U13.53(PB14) ; port TP_COMM.MISO
TP_MOSI: U13.54(PB15) ; port TP_COMM.MOSI
TP_PEN: U13.48(PB11) ; port TP_COMM.~{PEN}
TP_SCLK: U13.52(PB13) ; port TP_COMM.SCLK
UI_BACKLIGHT: U13.59(PD12) ; port SCREEN_COMM.BACKLIGHT  [project net BACKLIGHT_CTRL]
UI_BUZZER: U13.35(PB0) ; port BUZZER
UI_LED_B: U13.80(PC12) ; port LEDS.BLUE
UI_LED_G: U13.79(PC11) ; port LEDS.GREEN
UI_LED_R: U13.78(PC10) ; port LEDS.RED
VDD_AFE_A_EN: U13.18(PC3) ; port REG_EN.AFE_A_EN
VDD_AFE_D_EN: U13.17(PC2) ; port REG_EN.AFE_D_EN
VDD_RF_IO_EN: U13.64(PC7) ; port REG_EN.RF_IO_EN
VDD_RF_PW_EN: U13.63(PC6) ; port REG_EN.RF_PW_EN
VDD_SCREEN_EN: U13.34(PC5) ; port REG_EN.SCREEN_EN
WAKEUP: C60.2 R45.2 U13.23(PA0-WKUP1)
X1_N: C64.2 U13.13(PH1-OSC_OUT) X1.1
X1_P: C65.2 U13.12(PH0-OSC_IN) X1.3
X2_N: C62.2 U13.9(PC15-OSC32_OUT) X2.1
X2_P: C61.2 U13.8(PC14-OSC32_IN) X2.2
NetJ5_1: J5.1(VCC) R46.2
NetJ5_7: J5.7(RTCK) R47.2
NetR44_2: R44.2 R45.1 SW1.1

Not connected (* = marked no-connect by the designer): SW1 3 4; U13 1(PE2) 6(VLCD) 7(PC13-WKUP2) 15(PC0) 16(PC1) 33(PC4) 36(PB1) 60(PD13) 65(PC8) 73(PH2) 83(PD2) 84(PD3) 87(PD6) 91(PB5) 95(PB8) 96(PB9) 97(PE0) 98(PE1)

### Buses and harness runs
bus FSMC_D[15..0]

### Layout directives
differential pair: X1_N, X1_P, X2_N, X2_P

### Notes on the sheet
- PA8 is clock output
- Create a small GND plane
  for each crystal and its
  caps isolated from the
  GND of the top layer
- Project:
- Title:
- Sheet
- Author:
- of
- Date:

### Library data of the parts
C60-C73 = Capacitor: Rated Voltage: *
  C60: Value: 0.47u
  C61 C62: Value: 6p
  C63: Value: 10n
  C64 C65: Value: 10p
  C66: Value: 10u
  C67-C71 C73: Value: 0.1u
  C72: Value: 1u
J5 = 3220-10-0200-00: Conn - JTAG, Header, Male, Right Angle, 10 Pin, 1.27mm Pitch, ARM Standard; Supplier 1: Digi-Key; Supplier Part Number 1: 1175-1628-ND
R44-R51 = Resistor: Power: *
  R44 R47-R51: Value: 10k
  R45: Value: 100k
  R46: Value: 0
SW1 = WS-TASU 436331045822: Switch - Tactile, Off-Mom, SPST, Side-Actuated; Supplier 1: Digi-Key; Supplier Part Number 1: 732-7059-1-ND
SW2 = EVQ-Q2K01W: Switch - Tactile, Off-Mom, SPST; Supplier 1: Digi-Key; Supplier Part Number 1: P12941SCT-ND
U13 = STM32L162VDT6: ARM Cortex-M3 32-bit MCU, 384 KB Flash, 48 KB Internal RAM, 83 I/Os, 100-pin LQFP, -40 to 85 degC, Tray; Manufacturer: STMicroelectronics; D/A Converter: 2x12-bit (2 Channel); Data E2PROM nom (B): 12288; Display controller: LCD 4x44/8x40; FLASH Size (Prog) (kB): 384; I/Os (High Current): 83; Integrated op-amps: 3; Internal RAM Size (kB): 48; Operating Frequency(F) (Processor speed) (MHz): 32; Supply Voltage(Vcc) min (V): 1.65; DatasheetVersion: Rev. 4; PackageVersion: Rev. 1, 06/2013; PackageReference: LQFP100; PackageDescription: 100-Pin Low Profile Quad Flat Package, 14 x 14 mm Body, 0.5 mm Pitch; Core: ARM Cortex-M3; Packing: Tray; Mounting Technology: Surface Mount; PartNumber: STM32L162VDT6; ComponentLink1Description: Manufacturer URL; ComponentLink1URL: http://www.st.com/web/en/home.html; ComponentLink2Description: Datasheet; ComponentLink2URL: http://www.st.com/st-web-ui/static/active/en/resource/technical/document/datasheet/DM00039232.pdf; ComponentLink3Description: Package Specification; ComponentLink3URL: http://www.st.com/st-web-ui/static/active/en/resource/technical/document/data_brief/DM00071938.pdf; Supplier 1: Farnell; Supplier Part Number 1: 2333341; Supplier 2: Mouser; Supplier Part Number 2: 511-STM32L162VDT6
X1 = ABM3B-16.000MHZ-10-1-U: Crystal - 16 MHz; Load Capacitance: 10 pF; ESR: 50 m; Supplier 1: Digi-Key; Supplier Part Number 1: 300-8206-1-ND
X2 = ABS07-120-32.768KHZ-T: Crystal - 32.768 kHz; Load Capacitance: 6 pF; Supplier 1: Digi-Key; Supplier Part Number 1: 535-11937-1-ND

## Nets that join several sheets
AGND: AFE (20 pins), Battery (23 pins), Voltage Regulation (25 pins), RF (43 pins), User Interface (14 pins), MCU (32 pins)
VDD_AFE_A: AFE (9 pins), Voltage Regulation (C40.2 U9.5)
VDD_AFE_D: AFE (C12.2 C13.2 R12.1 U1.23), Voltage Regulation (C38.2 U8.5)
VDD_MCU: Battery (6 pins), Voltage Regulation (C29.2 U4.5), RF (C41.2 U10.10 U10.13 U10.14), User Interface (D6.4 Z1.1), MCU (19 pins)
VDD_RF_IO: Voltage Regulation (C36.2 U7.5), RF (15 pins)
VDD_RF_PW: Voltage Regulation (C34.2 U6.5), RF (C46.2 U12.B5 U12.B6)
VDD_SCREEN: Voltage Regulation (C32.2 U5.1), User Interface (J4.39)
VSYS: Battery (5 pins), Voltage Regulation (13 pins)
AFE_CS: AFE (U1.18), MCU (U13.29)
AFE_DIN: AFE (U1.19), MCU (U13.32)
AFE_DOUT: AFE (U1.21), MCU (U13.31)
AFE_DRDY: AFE (U1.22), MCU (U13.24)
AFE_RESET: AFE (U1.15), MCU (U13.25)
AFE_SCLK: AFE (U1.20), MCU (U13.30)
AFE_START: AFE (U1.16), MCU (U13.26)
BACKLIGHT_CTRL: User Interface (J4.2), MCU (U13.59)
CHRG_CHG: Battery (R29.2 U3.8), MCU (U13.4)
CHRG_JACK_DET: Battery (C27.2 R28.1), MCU (U13.5)
CHRG_PG: Battery (R30.2 U3.5), MCU (U13.3)
FG_GPOUT: Battery (R18.2 U2.12), MCU (U13.2)
FG_SCL: Battery (R20.2 R22.1 U2.2), MCU (U13.92)
FG_SDA: Battery (R19.2 R21.1 U2.1), MCU (U13.93)
FSMC_A16: User Interface (J4.37), MCU (U13.58)
FSMC_D0: User Interface (J4.32), MCU (U13.61)
FSMC_D1: User Interface (J4.31), MCU (U13.62)
FSMC_D2: User Interface (J4.30), MCU (U13.81)
FSMC_D3: User Interface (J4.29), MCU (U13.82)
FSMC_D4: User Interface (J4.28), MCU (U13.38)
FSMC_D5: User Interface (J4.27), MCU (U13.39)
FSMC_D6: User Interface (J4.26), MCU (U13.40)
FSMC_D7: User Interface (J4.25), MCU (U13.41)
FSMC_D8: User Interface (J4.24), MCU (U13.42)
FSMC_D9: User Interface (J4.23), MCU (U13.43)
FSMC_D10: User Interface (J4.22), MCU (U13.44)
FSMC_D11: User Interface (J4.21), MCU (U13.45)
FSMC_D12: User Interface (J4.20), MCU (U13.46)
FSMC_D13: User Interface (J4.19), MCU (U13.55)
FSMC_D14: User Interface (J4.18), MCU (U13.56)
FSMC_D15: User Interface (J4.17), MCU (U13.57)
FSMC_NE1: User Interface (J4.38), MCU (U13.88)
FSMC_NOE: User Interface (J4.36), MCU (U13.85)
FSMC_NWE: User Interface (J4.35), MCU (U13.86)
HCI_CTS: RF (U11.5), MCU (U13.71)
HCI_RTS: RF (U10.6), MCU (U13.70)
HCI_RX: RF (U11.2), MCU (U13.68)
HCI_TX: RF (U10.3), MCU (U13.69)
nSHUTD: RF (U11.9), MCU (U13.66)
SLOW_CLK: RF (U11.12), MCU (U13.67)
TP_BUSY: User Interface (J4.4), MCU (U13.47)
TP_CS: User Interface (J4.8), MCU (U13.51)
TP_MISO: User Interface (J4.5), MCU (U13.53)
TP_MOSI: User Interface (J4.6), MCU (U13.54)
TP_PEN: User Interface (J4.3), MCU (U13.48)
TP_SCLK: User Interface (J4.7), MCU (U13.52)
UI_BUZZER: User Interface (R36.1), MCU (U13.35)
UI_LED_B: User Interface (R42.2), MCU (U13.80)
UI_LED_G: User Interface (R40.1), MCU (U13.79)
UI_LED_R: User Interface (R38.1), MCU (U13.78)
VDD_AFE_A_EN: Voltage Regulation (R35.1 U9.3), MCU (U13.18)
VDD_AFE_D_EN: Voltage Regulation (R34.1 U8.3), MCU (U13.17)
VDD_RF_IO_EN: Voltage Regulation (R33.1 U7.3), MCU (U13.64)
VDD_RF_PW_EN: Voltage Regulation (R32.1 U6.3), MCU (U13.63)
VDD_SCREEN_EN: Voltage Regulation (R31.1 U5.5), MCU (U13.34)

## Assembly variants
H2H Main Board (Main Flash Boot): not fitted R21 R22 R47 R48 R50